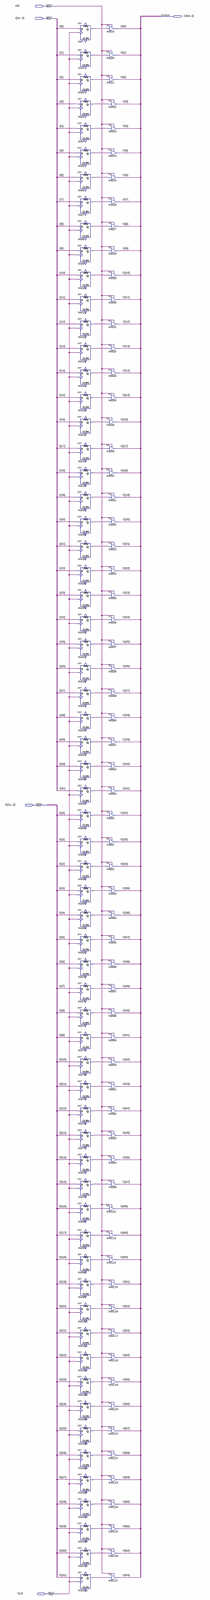
[diagram p0: schematic sheet, whole]
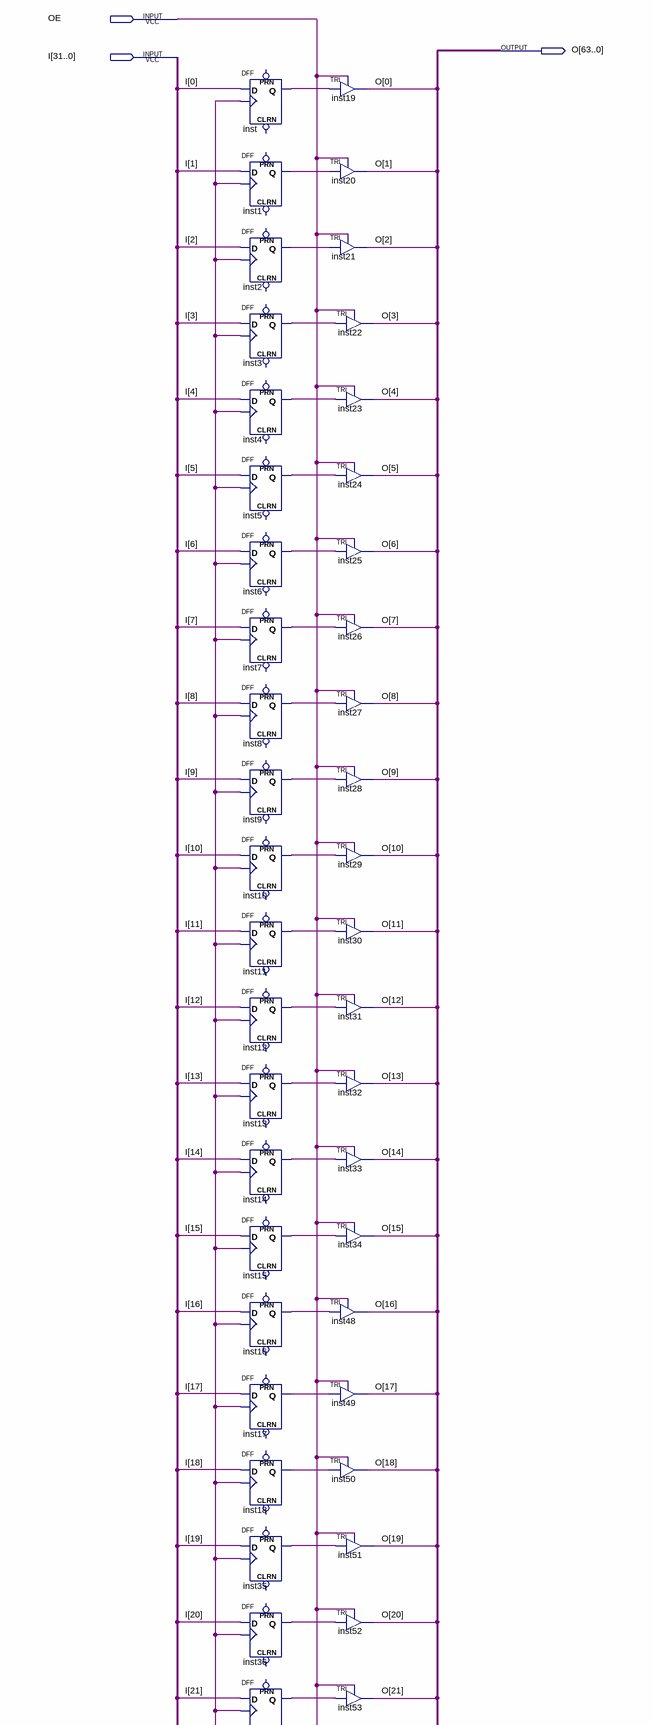
[diagram p1: schematic sheet, upper part]
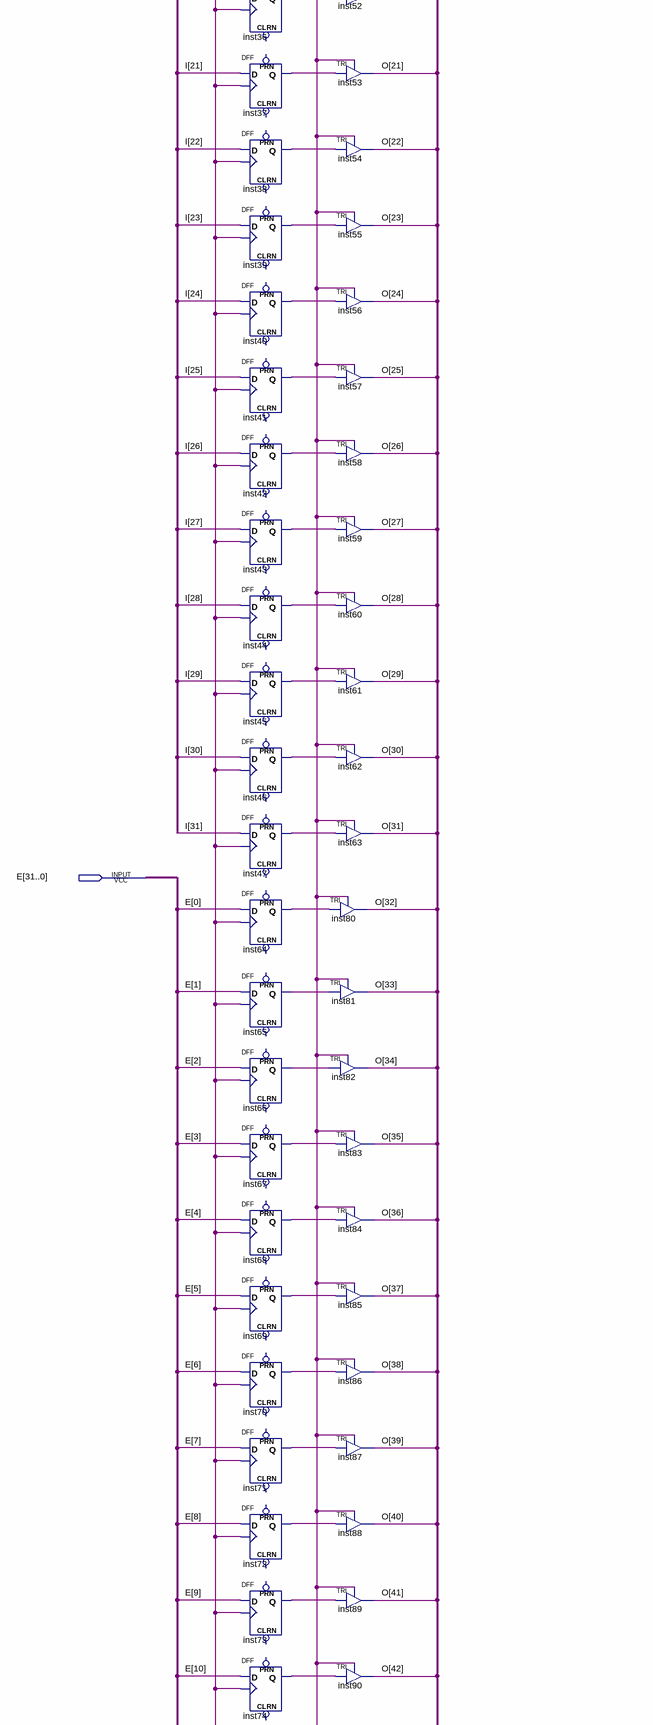
[diagram p2: schematic sheet, middle part]
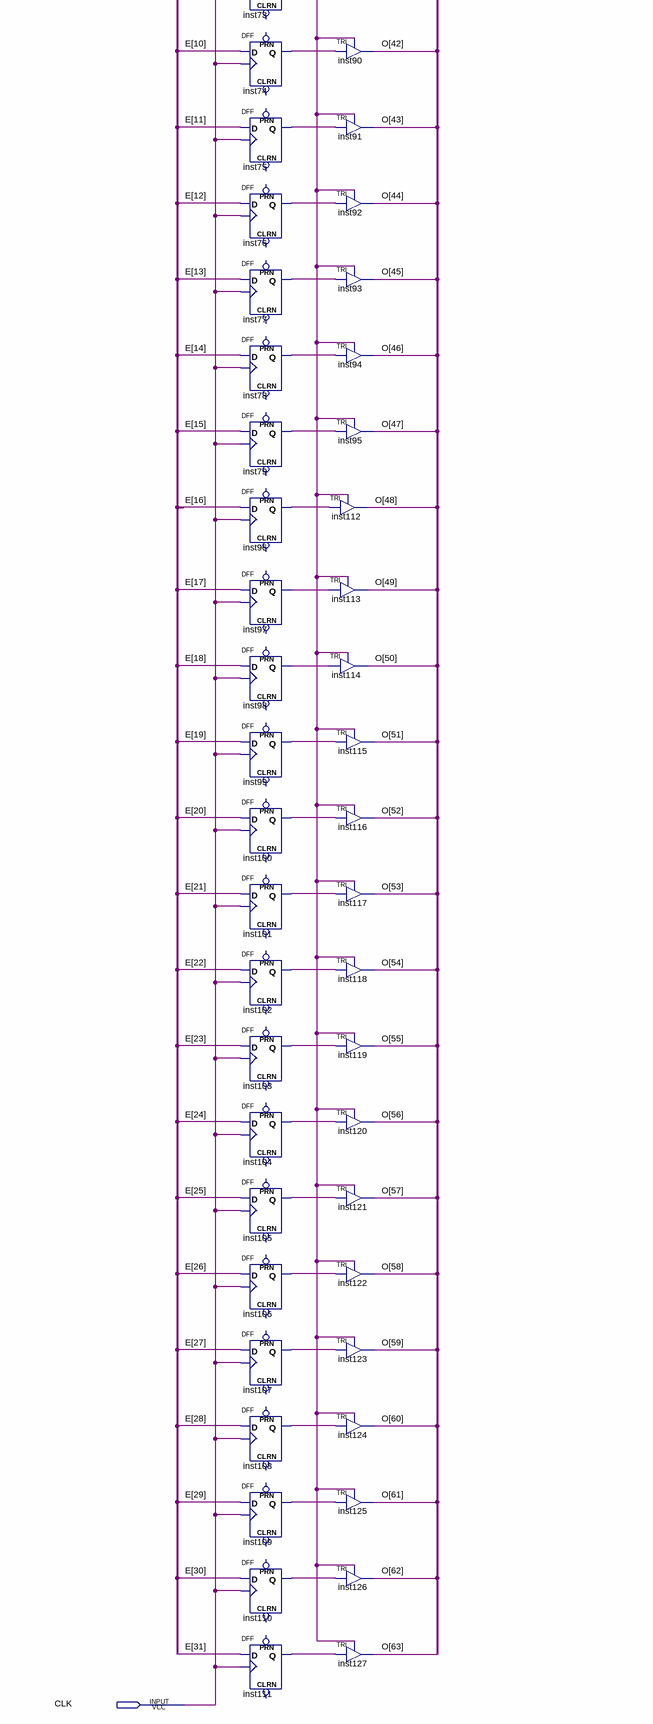
[diagram p3: schematic sheet, lower part]
// Quartus schematic Reg64_out.bdf as structural Verilog: 128 symbols, 5 pins
module Reg64_out (
  input  OE,
  input  [31:0] I,
  input  [31:0] E,
  input  CLK,
  output [63:0] O
);

  wire inst1_q, inst2_q, inst3_q, inst4_q, inst5_q, inst6_q, inst7_q, inst8_q, inst9_q, inst10_q, inst11_q,
       inst12_q, inst13_q, inst14_q, inst15_q, inst16_q, inst17_q, inst18_q, inst35_q, inst36_q, inst37_q,
       inst38_q, inst39_q, inst40_q, inst41_q, inst42_q, inst43_q, inst44_q, inst45_q, inst46_q, inst47_q,
       inst64_q, inst65_q, inst66_q, inst67_q, inst68_q, inst69_q, inst70_q, inst71_q, inst72_q, inst73_q,
       inst74_q, inst75_q, inst76_q, inst77_q, inst78_q, inst79_q, inst96_q, inst97_q, inst98_q, inst99_q,
       inst100_q, inst101_q, inst102_q, inst103_q, inst104_q, inst105_q, inst106_q, inst107_q, inst108_q,
       inst109_q, inst110_q, inst111_q, inst_q;

  DFF inst (.CLK(CLK), .D(I[0]), .Q(inst_q));  // open: CLRN, PRN
  DFF inst1 (.CLK(CLK), .D(I[1]), .Q(inst1_q));  // open: CLRN, PRN
  DFF inst2 (.CLK(CLK), .D(I[2]), .Q(inst2_q));  // open: CLRN, PRN
  DFF inst3 (.CLK(CLK), .D(I[3]), .Q(inst3_q));  // open: CLRN, PRN
  DFF inst4 (.CLK(CLK), .D(I[4]), .Q(inst4_q));  // open: CLRN, PRN
  DFF inst5 (.CLK(CLK), .D(I[5]), .Q(inst5_q));  // open: CLRN, PRN
  DFF inst6 (.CLK(CLK), .D(I[6]), .Q(inst6_q));  // open: CLRN, PRN
  DFF inst7 (.CLK(CLK), .D(I[7]), .Q(inst7_q));  // open: CLRN, PRN
  DFF inst8 (.CLK(CLK), .D(I[8]), .Q(inst8_q));  // open: CLRN, PRN
  DFF inst9 (.CLK(CLK), .D(I[9]), .Q(inst9_q));  // open: CLRN, PRN
  DFF inst10 (.CLK(CLK), .D(I[10]), .Q(inst10_q));  // open: CLRN, PRN
  DFF inst11 (.CLK(CLK), .D(I[11]), .Q(inst11_q));  // open: CLRN, PRN
  DFF inst12 (.CLK(CLK), .D(I[12]), .Q(inst12_q));  // open: CLRN, PRN
  DFF inst13 (.CLK(CLK), .D(I[13]), .Q(inst13_q));  // open: CLRN, PRN
  DFF inst14 (.CLK(CLK), .D(I[14]), .Q(inst14_q));  // open: CLRN, PRN
  DFF inst15 (.CLK(CLK), .D(I[15]), .Q(inst15_q));  // open: CLRN, PRN
  DFF inst16 (.CLK(CLK), .D(I[16]), .Q(inst16_q));  // open: CLRN, PRN
  DFF inst17 (.CLK(CLK), .D(I[17]), .Q(inst17_q));  // open: CLRN, PRN
  DFF inst18 (.CLK(CLK), .D(I[18]), .Q(inst18_q));  // open: CLRN, PRN
  DFF inst35 (.CLK(CLK), .D(I[19]), .Q(inst35_q));  // open: CLRN, PRN
  DFF inst36 (.CLK(CLK), .D(I[20]), .Q(inst36_q));  // open: CLRN, PRN
  DFF inst37 (.CLK(CLK), .D(I[21]), .Q(inst37_q));  // open: CLRN, PRN
  DFF inst38 (.CLK(CLK), .D(I[22]), .Q(inst38_q));  // open: CLRN, PRN
  DFF inst39 (.CLK(CLK), .D(I[23]), .Q(inst39_q));  // open: CLRN, PRN
  DFF inst40 (.CLK(CLK), .D(I[24]), .Q(inst40_q));  // open: CLRN, PRN
  DFF inst41 (.CLK(CLK), .D(I[25]), .Q(inst41_q));  // open: CLRN, PRN
  DFF inst42 (.CLK(CLK), .D(I[26]), .Q(inst42_q));  // open: CLRN, PRN
  DFF inst43 (.CLK(CLK), .D(I[27]), .Q(inst43_q));  // open: CLRN, PRN
  DFF inst44 (.CLK(CLK), .D(I[28]), .Q(inst44_q));  // open: CLRN, PRN
  DFF inst45 (.CLK(CLK), .D(I[29]), .Q(inst45_q));  // open: CLRN, PRN
  DFF inst46 (.CLK(CLK), .D(I[30]), .Q(inst46_q));  // open: CLRN, PRN
  DFF inst47 (.CLK(CLK), .D(I[31]), .Q(inst47_q));  // open: CLRN, PRN
  DFF inst64 (.CLK(CLK), .D(E[0]), .Q(inst64_q));  // open: CLRN, PRN
  DFF inst65 (.CLK(CLK), .D(E[1]), .Q(inst65_q));  // open: CLRN, PRN
  DFF inst66 (.CLK(CLK), .D(E[2]), .Q(inst66_q));  // open: CLRN, PRN
  DFF inst67 (.CLK(CLK), .D(E[3]), .Q(inst67_q));  // open: CLRN, PRN
  DFF inst68 (.CLK(CLK), .D(E[4]), .Q(inst68_q));  // open: CLRN, PRN
  DFF inst69 (.CLK(CLK), .D(E[5]), .Q(inst69_q));  // open: CLRN, PRN
  DFF inst70 (.CLK(CLK), .D(E[6]), .Q(inst70_q));  // open: CLRN, PRN
  DFF inst71 (.CLK(CLK), .D(E[7]), .Q(inst71_q));  // open: CLRN, PRN
  DFF inst72 (.CLK(CLK), .D(E[8]), .Q(inst72_q));  // open: CLRN, PRN
  DFF inst73 (.CLK(CLK), .D(E[9]), .Q(inst73_q));  // open: CLRN, PRN
  DFF inst74 (.CLK(CLK), .D(E[10]), .Q(inst74_q));  // open: CLRN, PRN
  DFF inst75 (.CLK(CLK), .D(E[11]), .Q(inst75_q));  // open: CLRN, PRN
  DFF inst76 (.CLK(CLK), .D(E[12]), .Q(inst76_q));  // open: CLRN, PRN
  DFF inst77 (.CLK(CLK), .D(E[13]), .Q(inst77_q));  // open: CLRN, PRN
  DFF inst78 (.CLK(CLK), .D(E[14]), .Q(inst78_q));  // open: CLRN, PRN
  DFF inst79 (.CLK(CLK), .D(E[15]), .Q(inst79_q));  // open: CLRN, PRN
  DFF inst96 (.CLK(CLK), .D(E[16]), .Q(inst96_q));  // open: CLRN, PRN
  DFF inst97 (.CLK(CLK), .D(E[17]), .Q(inst97_q));  // open: CLRN, PRN
  DFF inst98 (.CLK(CLK), .D(E[18]), .Q(inst98_q));  // open: CLRN, PRN
  DFF inst99 (.CLK(CLK), .D(E[19]), .Q(inst99_q));  // open: CLRN, PRN
  DFF inst100 (.CLK(CLK), .D(E[20]), .Q(inst100_q));  // open: CLRN, PRN
  DFF inst101 (.CLK(CLK), .D(E[21]), .Q(inst101_q));  // open: CLRN, PRN
  DFF inst102 (.CLK(CLK), .D(E[22]), .Q(inst102_q));  // open: CLRN, PRN
  DFF inst103 (.CLK(CLK), .D(E[23]), .Q(inst103_q));  // open: CLRN, PRN
  DFF inst104 (.CLK(CLK), .D(E[24]), .Q(inst104_q));  // open: CLRN, PRN
  DFF inst105 (.CLK(CLK), .D(E[25]), .Q(inst105_q));  // open: CLRN, PRN
  DFF inst106 (.CLK(CLK), .D(E[26]), .Q(inst106_q));  // open: CLRN, PRN
  DFF inst107 (.CLK(CLK), .D(E[27]), .Q(inst107_q));  // open: CLRN, PRN
  DFF inst108 (.CLK(CLK), .D(E[28]), .Q(inst108_q));  // open: CLRN, PRN
  DFF inst109 (.CLK(CLK), .D(E[29]), .Q(inst109_q));  // open: CLRN, PRN
  DFF inst110 (.CLK(CLK), .D(E[30]), .Q(inst110_q));  // open: CLRN, PRN
  DFF inst111 (.CLK(CLK), .D(E[31]), .Q(inst111_q));  // open: CLRN, PRN
  TRI inst19 (.IN(inst_q), .OE(OE), .OUT(O[0]));
  TRI inst20 (.IN(inst1_q), .OE(OE), .OUT(O[1]));
  TRI inst21 (.IN(inst2_q), .OE(OE), .OUT(O[2]));
  TRI inst22 (.IN(inst3_q), .OE(OE), .OUT(O[3]));
  TRI inst23 (.IN(inst4_q), .OE(OE), .OUT(O[4]));
  TRI inst24 (.IN(inst5_q), .OE(OE), .OUT(O[5]));
  TRI inst25 (.IN(inst6_q), .OE(OE), .OUT(O[6]));
  TRI inst26 (.IN(inst7_q), .OE(OE), .OUT(O[7]));
  TRI inst27 (.IN(inst8_q), .OE(OE), .OUT(O[8]));
  TRI inst28 (.IN(inst9_q), .OE(OE), .OUT(O[9]));
  TRI inst29 (.IN(inst10_q), .OE(OE), .OUT(O[10]));
  TRI inst30 (.IN(inst11_q), .OE(OE), .OUT(O[11]));
  TRI inst31 (.IN(inst12_q), .OE(OE), .OUT(O[12]));
  TRI inst32 (.IN(inst13_q), .OE(OE), .OUT(O[13]));
  TRI inst33 (.IN(inst14_q), .OE(OE), .OUT(O[14]));
  TRI inst34 (.IN(inst15_q), .OE(OE), .OUT(O[15]));
  TRI inst48 (.IN(inst16_q), .OE(OE), .OUT(O[16]));
  TRI inst49 (.IN(inst17_q), .OE(OE), .OUT(O[17]));
  TRI inst50 (.IN(inst18_q), .OE(OE), .OUT(O[18]));
  TRI inst51 (.IN(inst35_q), .OE(OE), .OUT(O[19]));
  TRI inst52 (.IN(inst36_q), .OE(OE), .OUT(O[20]));
  TRI inst53 (.IN(inst37_q), .OE(OE), .OUT(O[21]));
  TRI inst54 (.IN(inst38_q), .OE(OE), .OUT(O[22]));
  TRI inst55 (.IN(inst39_q), .OE(OE), .OUT(O[23]));
  TRI inst56 (.IN(inst40_q), .OE(OE), .OUT(O[24]));
  TRI inst57 (.IN(inst41_q), .OE(OE), .OUT(O[25]));
  TRI inst58 (.IN(inst42_q), .OE(OE), .OUT(O[26]));
  TRI inst59 (.IN(inst43_q), .OE(OE), .OUT(O[27]));
  TRI inst60 (.IN(inst44_q), .OE(OE), .OUT(O[28]));
  TRI inst61 (.IN(inst45_q), .OE(OE), .OUT(O[29]));
  TRI inst62 (.IN(inst46_q), .OE(OE), .OUT(O[30]));
  TRI inst63 (.IN(inst47_q), .OE(OE), .OUT(O[31]));
  TRI inst80 (.IN(inst64_q), .OE(OE), .OUT(O[32]));
  TRI inst81 (.IN(inst65_q), .OE(OE), .OUT(O[33]));
  TRI inst82 (.IN(inst66_q), .OE(OE), .OUT(O[34]));
  TRI inst83 (.IN(inst67_q), .OE(OE), .OUT(O[35]));
  TRI inst84 (.IN(inst68_q), .OE(OE), .OUT(O[36]));
  TRI inst85 (.IN(inst69_q), .OE(OE), .OUT(O[37]));
  TRI inst86 (.IN(inst70_q), .OE(OE), .OUT(O[38]));
  TRI inst87 (.IN(inst71_q), .OE(OE), .OUT(O[39]));
  TRI inst88 (.IN(inst72_q), .OE(OE), .OUT(O[40]));
  TRI inst89 (.IN(inst73_q), .OE(OE), .OUT(O[41]));
  TRI inst90 (.IN(inst74_q), .OE(OE), .OUT(O[42]));
  TRI inst91 (.IN(inst75_q), .OE(OE), .OUT(O[43]));
  TRI inst92 (.IN(inst76_q), .OE(OE), .OUT(O[44]));
  TRI inst93 (.IN(inst77_q), .OE(OE), .OUT(O[45]));
  TRI inst94 (.IN(inst78_q), .OE(OE), .OUT(O[46]));
  TRI inst95 (.IN(inst79_q), .OE(OE), .OUT(O[47]));
  TRI inst112 (.IN(inst96_q), .OE(OE), .OUT(O[48]));
  TRI inst113 (.IN(inst97_q), .OE(OE), .OUT(O[49]));
  TRI inst114 (.IN(inst98_q), .OE(OE), .OUT(O[50]));
  TRI inst115 (.IN(inst99_q), .OE(OE), .OUT(O[51]));
  TRI inst116 (.IN(inst100_q), .OE(OE), .OUT(O[52]));
  TRI inst117 (.IN(inst101_q), .OE(OE), .OUT(O[53]));
  TRI inst118 (.IN(inst102_q), .OE(OE), .OUT(O[54]));
  TRI inst119 (.IN(inst103_q), .OE(OE), .OUT(O[55]));
  TRI inst120 (.IN(inst104_q), .OE(OE), .OUT(O[56]));
  TRI inst121 (.IN(inst105_q), .OE(OE), .OUT(O[57]));
  TRI inst122 (.IN(inst106_q), .OE(OE), .OUT(O[58]));
  TRI inst123 (.IN(inst107_q), .OE(OE), .OUT(O[59]));
  TRI inst124 (.IN(inst108_q), .OE(OE), .OUT(O[60]));
  TRI inst125 (.IN(inst109_q), .OE(OE), .OUT(O[61]));
  TRI inst126 (.IN(inst110_q), .OE(OE), .OUT(O[62]));
  TRI inst127 (.IN(inst111_q), .OE(OE), .OUT(O[63]));
endmodule
